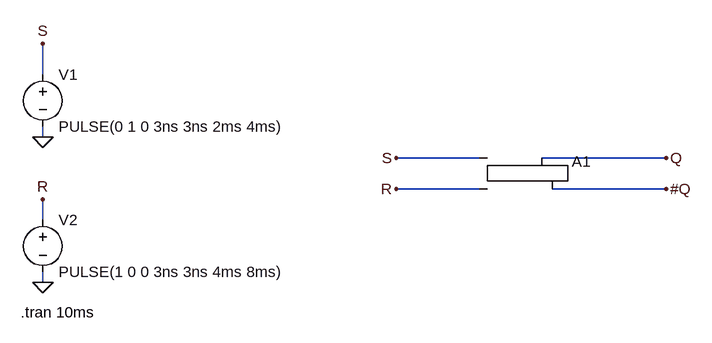
[diagram p0: schematic Latch.asc]
Latch.asc, the LTspice schematic file:
Version 4
SHEET 1 880 680
WIRE -496 16 -496 -32
WIRE -496 112 -496 96
WIRE 176 144 48 144
WIRE 464 144 272 144
WIRE 176 192 48 192
WIRE 464 192 288 192
WIRE -496 240 -496 208
WIRE -496 336 -496 320
FLAG 464 144 Q
FLAG 464 192 #Q
FLAG 48 192 R
FLAG 48 144 S
FLAG -496 112 0
FLAG -496 336 0
FLAG -496 208 R
FLAG -496 -32 S
SYMBOL voltage -496 0 R0
WINDOW 123 0 0 Left 0
WINDOW 39 0 0 Left 0
SYMATTR InstName V1
SYMATTR Value PULSE(0 1 0 3ns 3ns 2ms 4ms)
SYMBOL voltage -496 224 R0
WINDOW 123 0 0 Left 0
WINDOW 39 0 0 Left 0
SYMATTR InstName V2
SYMATTR Value PULSE(1 0 0 3ns 3ns 4ms 8ms)
SYMBOL Digital\\srflop 224 96 R0
SYMATTR InstName A1
TEXT -530 382 Left 2 !.tran 10ms

The netlist it stands for:
* Latch.asc
V1 S 0 PULSE(0 1 0 3ns 3ns 2ms 4ms)
V2 R 0 PULSE(1 0 0 3ns 3ns 4ms 8ms)
A1 S R 0 0 0 #Q Q 0 SRFLOP
.tran 10ms
.backanno
.end